# EAGLE design ltc3886circuit_rev1 (EAGLE 9.3.0)
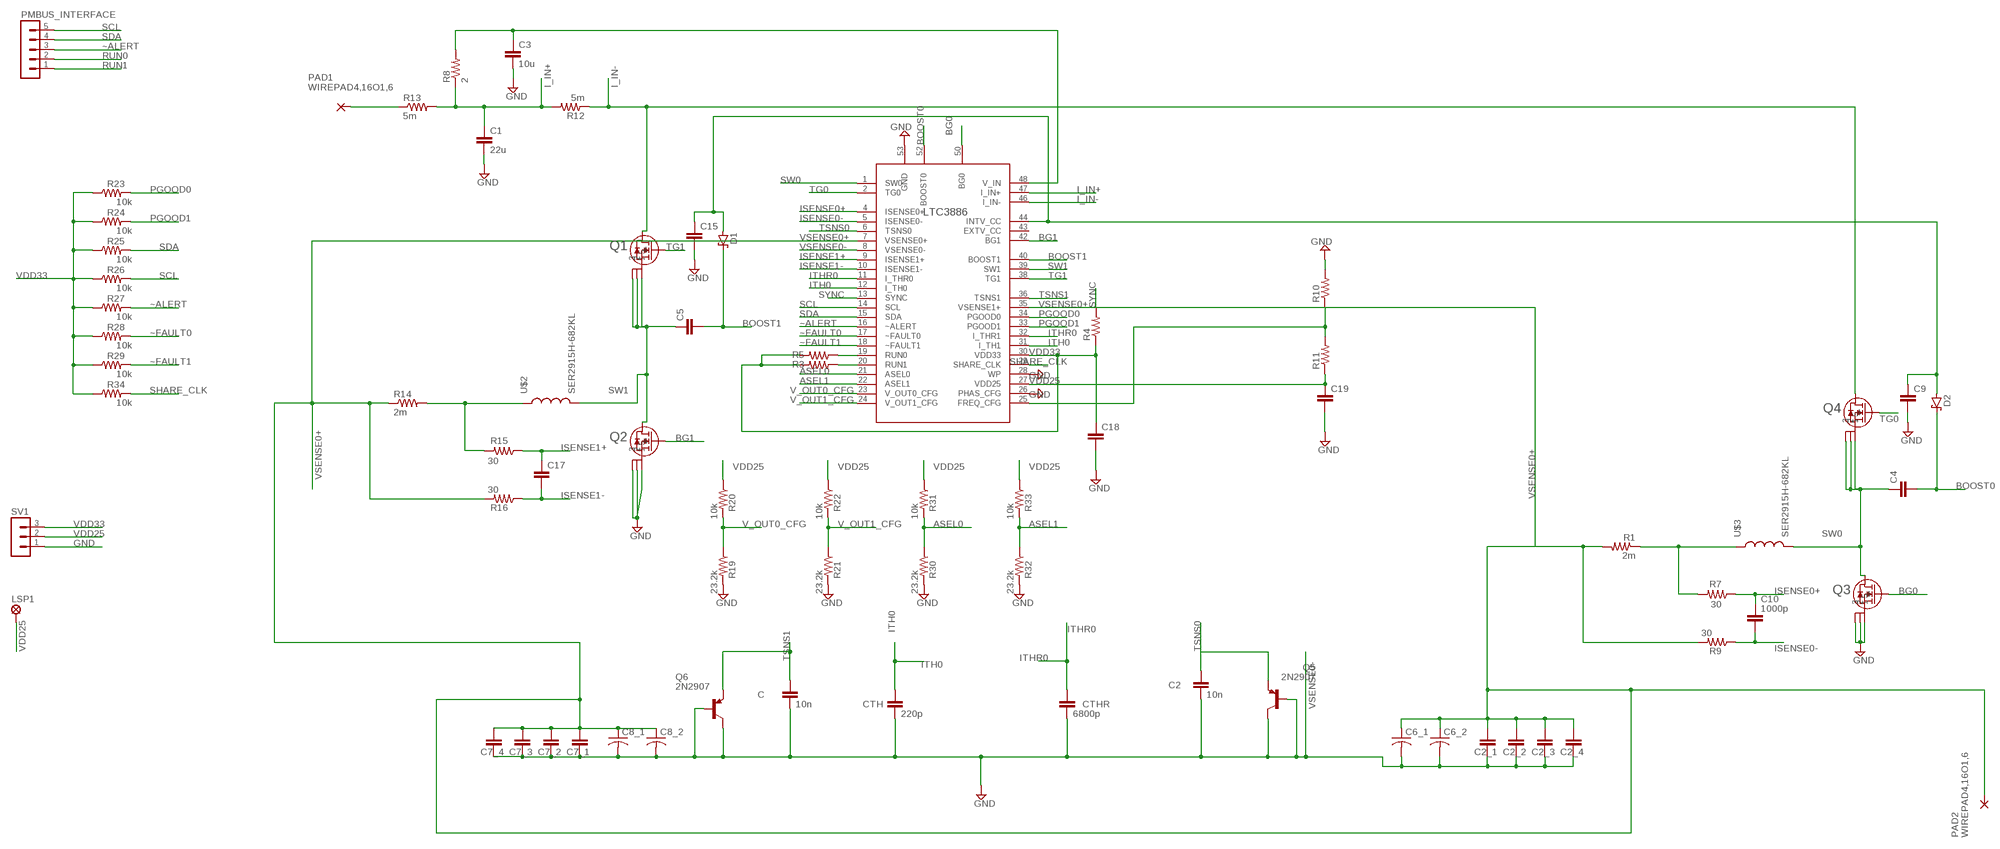
[diagram p0: schematic, sheet 1]

## Parts
C  10n  C-EU075-032X103  [C075-032X103]
C1  22u  C-EU075-032X103  [C075-032X103]
C2  10n  C-EU075-032X103  [C075-032X103]
C2_1  ESK226M100AE3AA(22UF_CAP)  [ESK226M100AE3AA(22UF_CAP)]
C2_2  ESK226M100AE3AA(22UF_CAP)  [ESK226M100AE3AA(22UF_CAP)]
C2_3  ESK226M100AE3AA(22UF_CAP)  [ESK226M100AE3AA(22UF_CAP)]
C2_4  ESK226M100AE3AA(22UF_CAP)  [ESK226M100AE3AA(22UF_CAP)]
C3  10u  C-EU075-032X103  [C075-032X103]
C4  C-EU075-032X103  [C075-032X103]
C5  C-EU075-032X103  [C075-032X103]
C6_1  C-US050-025X075  [C050-025X075]
C6_2  C-US050-025X075  [C050-025X075]
C7_1  ESK226M100AE3AA(22UF_CAP)  [ESK226M100AE3AA(22UF_CAP)]
C7_2  ESK226M100AE3AA(22UF_CAP)  [ESK226M100AE3AA(22UF_CAP)]
C7_3  ESK226M100AE3AA(22UF_CAP)  [ESK226M100AE3AA(22UF_CAP)]
C7_4  ESK226M100AE3AA(22UF_CAP)  [ESK226M100AE3AA(22UF_CAP)]
C8_1  C-US050-025X075  [C050-025X075]
C8_2  C-US050-025X075  [C050-025X075]
C9  C-EU075-032X103  [C075-032X103]
C10  1000p  C-EU075-032X103  [C075-032X103]
C15  C-EU075-032X103  [C075-032X103]
C17  C-EU075-032X103  [C075-032X103]
C18  C-EU075-032X103  [C075-032X103]
C19  C-EU075-032X103  [C075-032X103]
CTH  220p  C-EU075-032X103  [C075-032X103]
CTHR  6800p  C-EU075-032X103  [C075-032X103]
D1  SCHOTTKY-DIODECB417-15  [CB417-15]
D2  SCHOTTKY-DIODECB417-15  [CB417-15]
LSP1  MCS08  [MCS08]
PAD1  WIREPAD4,16O1,6  [4,16O1,6]
PAD2  WIREPAD4,16O1,6  [4,16O1,6]
PMBUS_INTERFACE  MA05-1  [MA05-1]
Q1  RJK0651DPB-00J5  [LFPAK]
Q2  RJK0651DPB-00J5  [LFPAK]
Q3  RJK0651DPB-00J5  [LFPAK]
Q4  RJK0651DPB-00J5  [LFPAK]
Q5  2N2907  [TO18]
Q6  2N2907  [TO18]
R1  2m  CSS2H-2512K-2L00FE  [CSS2H-2512K-2L00FE]
R3  R-US_0207/12  [0207/12]
R4  R-US_0207/12  [0207/12]
R5  R-US_0207/12  [0207/12]
R7  30  R-US_0207/12  [0207/12]
R8  2  ERJ-B1BF2R0U(2-OHM)  [ERJ-B1BF2R0U(2-OHM)]
R9  30  R-US_0207/12  [0207/12]
R10  R-US_0207/12  [0207/12]
R11  R-US_0207/12  [0207/12]
R12  5m  R-US_0204/5  [0204/5]
R13  5m  CSS2H-2512K-2L00FE  [CSS2H-2512K-2L00FE]
R14  2m  CSS2H-2512K-2L00FE  [CSS2H-2512K-2L00FE]
R15  30  R-US_0207/12  [0207/12]
R16  30  R-US_0207/12  [0207/12]
R19  23.2k  R-US_0207/12  [0207/12]
R20  10k  R-US_0207/12  [0207/12]
R21  23.2k  R-US_0207/12  [0207/12]
R22  10k  R-US_0207/12  [0207/12]
R23  10k  R-US_0207/12  [0207/12]
R24  10k  R-US_0207/12  [0207/12]
R25  10k  R-US_0207/12  [0207/12]
R26  10k  R-US_0207/12  [0207/12]
R27  10k  R-US_0207/12  [0207/12]
R28  10k  R-US_0207/12  [0207/12]
R29  10k  R-US_0207/12  [0207/12]
R30  23.2k  R-US_0207/12  [0207/12]
R31  10k  R-US_0207/12  [0207/12]
R32  23.2k  R-US_0207/12  [0207/12]
R33  10k  R-US_0207/12  [0207/12]
R34  10k  R-US_0207/12  [0207/12]
SV1  MA03-1  [MA03-1]
U$1  LTC3886  [QFN-52_UKG_2]
U$2  SER2915H-682KL  [SER2915H-682KL]
U$3  SER2915H-682KL  [SER2915H-682KL]

## Nets
ASEL0: R30.1 R31.2 U$1.21(ASEL0)
ASEL1: R32.1 R33.2 U$1.22(ASEL1)
BG0: Q3.4 U$1.50(BG0)
BG1: Q2.4 U$1.42(BG1)
BOOST0: C4.2 D2.C U$1.52(BOOST0)
BOOST1: C5.2 D1.C U$1.40(BOOST1)
GND: C1.2 C3.2 C9.2 C15.2 C18.2 C19.2 Q2.1 Q2.2 Q2.3 Q3.1 Q3.2 Q3.3 R10.2 R19.2 R21.2 R30.2 R32.2 SV1.1 U$1.26(PHAS_CFG) U$1.28(WP) U$1.53(GND)
I_IN+: C1.1 R8.P$1 R12.2 R13.P$2 U$1.47(I_IN+)
I_IN-: Q1.5 Q4.5 R12.1 U$1.46(I_IN-)
ISENSE0+: C10.1 R7.1 U$1.4(ISENSE0+)
ISENSE0-: C10.2 R9.1 U$1.5(ISENSE0-)
ISENSE1+: C17.1 R15.1 U$1.9(ISENSE1+)
ISENSE1-: C17.2 R16.1 U$1.10(ISENSE1-)
ITH0: CTH.1 U$1.12(I_TH0) U$1.31(I_TH1)
ITHR0: CTHR.1 U$1.11(I_THR0) U$1.32(I_THR1)
N$2: R5.1 U$1.19(RUN0)
N$3: R3.1 U$1.20(RUN1)
N$4: R14.P$2 R15.2 U$2.P$1
N$5: C9.1 C15.1 D1.A D2.A U$1.44(INTV_CC)
N$8: R1.P$1 R7.2 U$3.P$1
N$17: PAD1.1(P) R13.P$1
N$19: C3.1 R8.P$2 U$1.48(V_IN)
N$24: R10.1 R11.2 U$1.25(FREQ_CFG)
PGOOD0: R23.2 U$1.34(PGOOD0)
PGOOD1: R24.2 U$1.33(PGOOD1)
RUN0: PMBUS_INTERFACE.2
RUN1: PMBUS_INTERFACE.1
SCL: PMBUS_INTERFACE.5 R26.2 U$1.14(SCL)
SDA: PMBUS_INTERFACE.4 R25.2 U$1.15(SDA)
SHARE_CLK: R34.2 U$1.29(SHARE_CLK)
SW0: C4.1 Q3.5 Q4.1 Q4.2 Q4.3 U$1.1(SW0) U$3.P$2
SW1: C5.1 Q1.1 Q1.2 Q1.3 Q2.5 U$1.39(SW1) U$2.P$2
SYNC: R4.2 U$1.13(SYNC)
TG0: Q4.4 U$1.2(TG0)
TG1: Q1.4 U$1.38(TG1)
TSNS0: C2.1 Q5.1(E) U$1.6(TSNS0)
TSNS1: C.1 Q6.1(E) U$1.36(TSNS1)
V_OUT0_CFG: R19.1 R20.2 U$1.23(V_OUT0_CFG)
V_OUT1_CFG: R21.1 R22.2 U$1.24(V_OUT1_CFG)
VDD25: C19.1 LSP1.MP R11.1 R20.1 R22.1 R31.1 R33.1 SV1.2 U$1.27(VDD25)
VDD33: C18.1 R3.2 R4.1 R5.2 R23.1 R24.1 R25.1 R26.1 R27.1 R28.1 R29.1 R34.1 SV1.3 U$1.30(VDD33)
VSENSE0+: C2_1.P$1 C2_2.P$1 C2_3.P$1 C2_4.P$1 C6_1.1 C6_2.1 C7_1.P$1 C7_2.P$1 C7_3.P$1 C7_4.P$1 C8_1.1 C8_2.1 PAD2.1(P) R1.P$2 R9.2 R14.P$1 R16.2 U$1.7(VSENSE0+) U$1.35(VSENSE1+)
VSENSE0-: C2.2 C2_1.P$2 C2_2.P$2 C2_3.P$2 C2_4.P$2 C6_1.2 C6_2.2 C7_1.P$2 C7_2.P$2 C7_3.P$2 C7_4.P$2 C8_1.2 C8_2.2 C.2 CTH.2 CTHR.2 Q5.2(B) Q5.3(C) Q6.2(B) Q6.3(C) U$1.8(VSENSE0-) ; supply symbol labelled GND
~ALERT: PMBUS_INTERFACE.3 R27.2 U$1.16(~ALERT)
~FAULT0: R28.2 U$1.17(~FAULT0)
~FAULT1: R29.2 U$1.18(~FAULT1)
Unconnected: U$1.43(EXTV_CC)

## Library data of the parts
C C1-C5 C9 C10 C15 C17-C19 CTH CTHR = rcl:C-EU: CAPACITOR, European symbol; SPICEPREFIX: C
C2_1-C2_4 C7_1-C7_4 = power_subsystem_components:ESK226M100AE3AA(22UF_CAP)
C6_1 C6_2 C8_1 C8_2 = rcl:C-US: CAPACITOR, American symbol; SPICEPREFIX: C
D1 D2 = diode:SCHOTTKY-DIODE: Schottky Diode
LSP1 = solpad:MCS08: SOLDER PAD MC S0,8, drill 1.2 mm, distributor Buerklin, 08F130
PAD1 PAD2 = wirepad:WIREPAD: Wire PAD connect wire on PCB
PMBUS_INTERFACE = con-lstb:MA05-1: PIN HEADER; OC_FARNELL: unknown; OC_NEWARK: unknown
Q1-Q4 = SamacSys_Parts:RJK0651DPB-00J5; MANUFACTURER_PART_NUMBER: RJK0651DPB00#J5; VENDOR: Renesas Electronics
Q5 Q6 = transistor-pnp:2N2907*: PNP Transistor
R1 R13 R14 = power_subsystem_components:CSS2H-2512K-2L00FE
R3-R5 R7 R9-R12 R15 R16 R19-R34 = rcl:R-US_: RESISTOR, American symbol; SPICEPREFIX: R
R8 = power_subsystem_components:ERJ-B1BF2R0U(2-OHM)
SV1 = con-lstb:MA03-1: PIN HEADER; OC_FARNELL: unknown; OC_NEWARK: unknown
U$1 = ltc3886:LTC3886
U$2 U$3 = power_subsystem_components:SER2915H-682KL

## Board
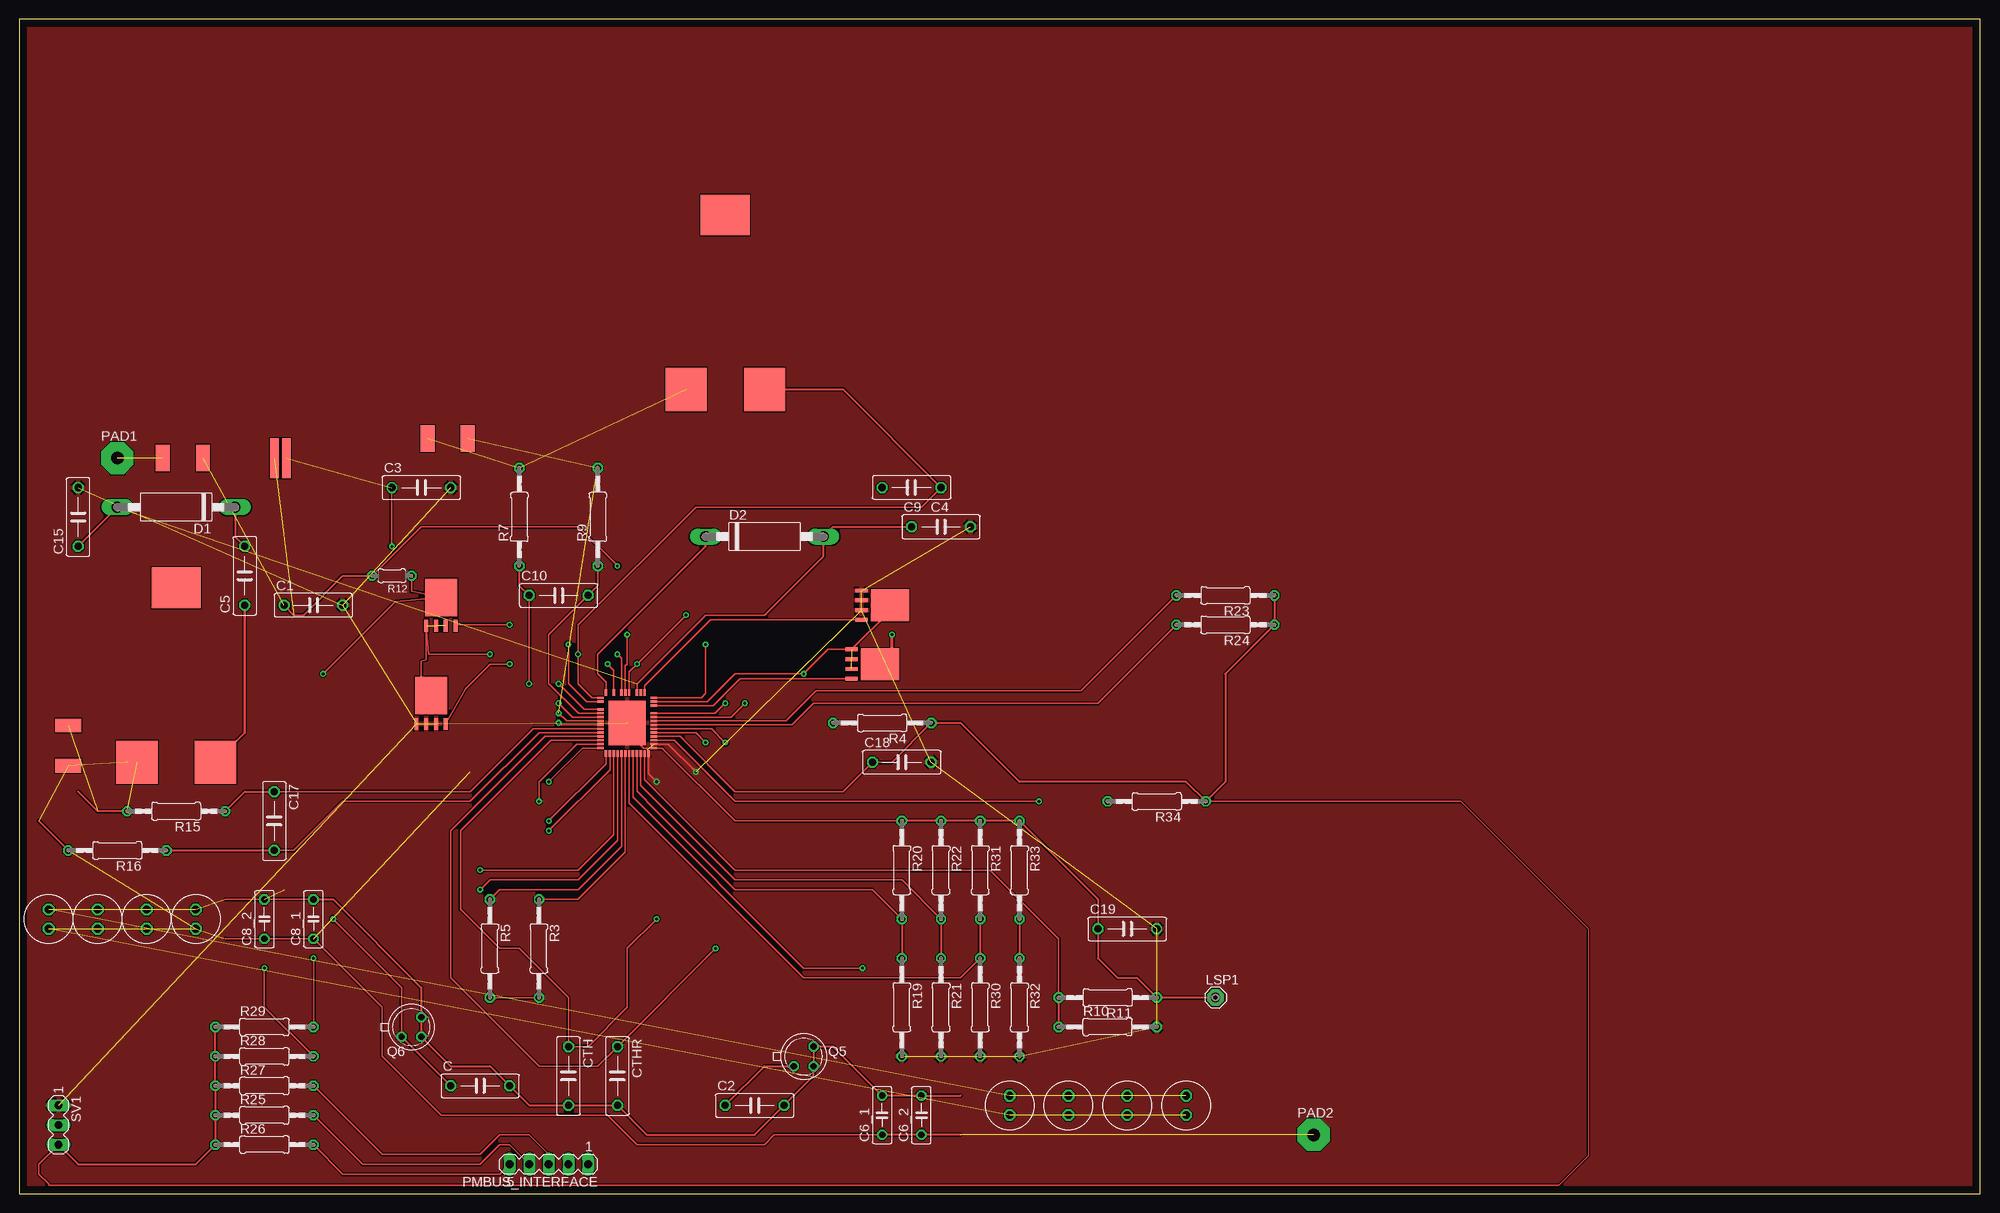
[diagram p1: board, top side]
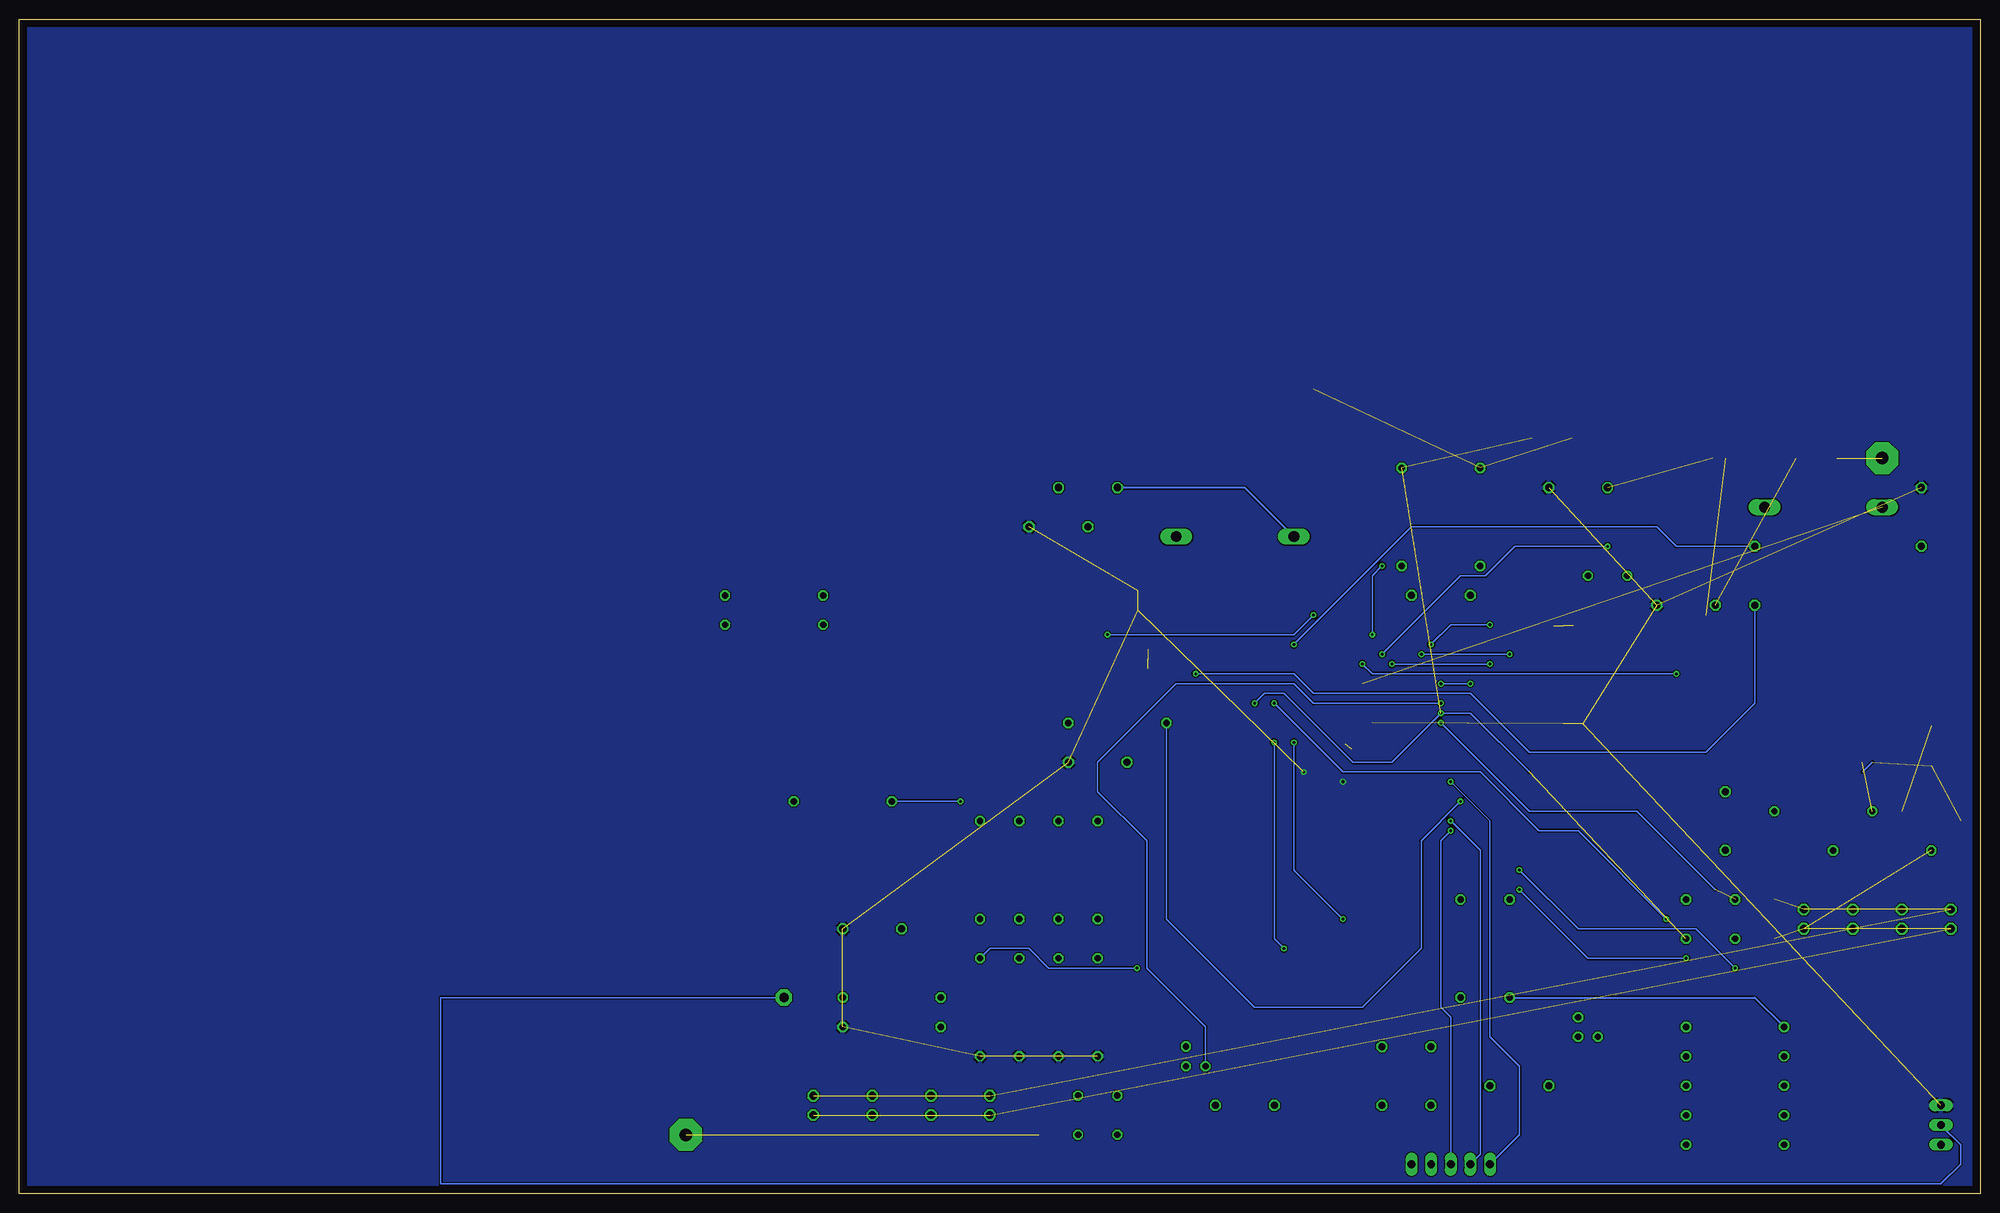
[diagram p2: board, bottom side, seen from below]

Size 253.98 x 152.07 mm. Coordinates in mm from the lower left corner, seen from the top.
Outline: 0,0 253.98,0 253.98,152.07 0,152.07 0,0
Copper layers (1*16): Top 0.035mm / dielectric 1.5mm / Bottom 0.035mm
Design rules "default": minimum track width 6mil, minimum drill 0.35mm, track to track 6mil, track to pad 6mil, pad to pad 6mil, via to via 6mil, smd to smd 6mil, copper to edge 40mil, drill to drill 6mil, minimum pad ring 10mil, minimum via ring 8mil, stop-mask expansion 4mil, vias tented up to drill 0mil, thermal gap 10mil

### Footprints (pad centres in the part's own frame; a part is rotated, then mirrored left to right if it is on the bottom)
C075-032X103 = drill 0.914 octagon: 1 -3.81,0; 2 3.81,0
ESK226M100AE3AA(22UF_CAP) = drill 1 octagon: P$1 -1.25,0; P$2 1.25,0
C050-025X075 = drill 0.813 octagon: 1 -2.54,0; 2 2.54,0
CB417-15 = drill 1.397 long: A 7.62,0; C -7.62,0
MCS08 = drill 1.194 pad 2.159 octagon: MP 0,0
4,16O1,6 = drill 1.6 pad 4.166 octagon: 1 0,0
MA05-1 = drill 1.016 long: 1 -5.08,0; 2 -2.54,0; 3 0,0; 4 2.54,0; 5 5.08,0
LFPAK = smd 1.549 x 0.508: 1 -2.68,1.905; 2 -2.68,0.635; 3 -2.68,-0.635; 4 -2.68,-1.905 | smd 4.902 x 4.14: 5 1.003,0
TO18 = drill 0.813 octagon: 1 -1.27,-1.27; 2 1.27,-1.27; 3 1.27,1.27
CSS2H-2512K-2L00FE = smd 1.8 x 3.4: P$1 -3,0; P$2 2.2,0
0207/12 = drill 0.813 octagon: 1 -6.35,0; 2 6.35,0
ERJ-B1BF2R0U(2-OHM) = smd 1.1 x 5.2: P$1 0,0; P$2 1.6,0
0204/5 = drill 0.813 octagon: 1 -2.54,0; 2 2.54,0
MA03-1 = drill 1.016 long: 1 -2.54,0; 2 0,0; 3 2.54,0
QFN-52_UKG_2 = smd 0.813 x 0.305: 1 -3.454,3.25; 2 -3.454,2.75; 4 -3.454,1.75; 5 -3.454,1.25; 6 -3.454,0.75; 7 -3.454,0.25; 8 -3.454,-0.25; 9 -3.454,-0.75; 10 -3.454,-1.25; 11 -3.454,-1.75; 12 -3.454,-2.25; 13 -3.454,-2.75; 14 -3.454,-3.25; 27 3.454,-3.25; 28 3.454,-2.75; 29 3.454,-2.25; 30 3.454,-1.75; 31 3.454,-1.25; 32 3.454,-0.75; 33 3.454,-0.25; 34 3.454,0.25; 35 3.454,0.75; 36 3.454,1.25; 38 3.454,2.25; 39 3.454,2.75; 40 3.454,3.25 | smd 0.305 x 0.813: 15 -2.75,-3.95; 16 -2.25,-3.95; 17 -1.75,-3.95; 18 -1.25,-3.95; 19 -0.75,-3.95; 20 -0.25,-3.95; 21 0.25,-3.95; 22 0.75,-3.95; 23 1.25,-3.95; 24 1.75,-3.95; 25 2.25,-3.95; 26 2.75,-3.95; 42 2.25,3.95; 43 1.75,3.95; 44 1.25,3.95; 46 0.25,3.95; 47 -0.25,3.95; 48 -0.75,3.95; 50 -1.75,3.95; 52 -2.75,3.95 | smd 4.801 x 5.791: 53 0,0
SER2915H-682KL = smd 5.33 x 5.59: P$1 -5.075,0; P$2 5.075,0 | smd 6.35 x 5.28: P$3 0,22.6

### Placement (x,y rotation side)
C  59.69,13.97 0 top
C1  38.1,76.2 0 top
C2  95.25,11.43 0 top
C2_1  151.13,11.43 90 top
C2_2  143.51,11.43 90 top
C2_3  135.89,11.43 90 top
C2_4  128.27,11.43 90 top
C3  52.07,91.44 0 top
C4  115.57,91.44 180 top
C5  29.21,80.01 90 top
C6_1  111.76,10.16 90 top
C6_2  116.84,10.16 90 top
C7_1  3.81,35.56 90 top
C7_2  10.16,35.56 90 top
C7_3  16.51,35.56 90 top
C7_4  22.86,35.56 90 top
C8_1  38.1,35.56 90 top
C8_2  31.75,35.56 90 top
C9  119.38,86.36 0 top
C10  69.85,77.47 0 top
C15  7.62,87.63 90 top
C17  33.02,48.26 270 top
C18  114.3,55.88 0 top
C19  143.51,34.29 0 top
CTH  71.12,15.24 270 top
CTHR  77.47,15.24 270 top
D1  20.32,88.9 180 top
D2  96.52,85.09 0 top
LSP1  154.94,25.4 0 top
PAD1  12.7,95.25 0 top
PAD2  167.64,7.62 0 top
PMBUS_INTERFACE  68.58,3.81 180 top
Q1  110.49,68.58 0 top
Q2  111.76,76.2 0 top
Q3  53.34,63.5 90 top
Q4  54.61,76.2 90 top
Q5  101.6,17.78 0 top
Q6  50.8,21.59 0 top
R1  55.88,97.79 0 top
R3  67.31,31.75 270 top
R4  111.76,60.96 180 top
R5  60.96,31.75 270 top
R7  64.77,87.63 90 top
R8  33.02,95.25 0 top
R9  74.93,87.63 90 top
R10  140.97,21.59 0 top
R11  140.97,25.4 180 top
R12  48.26,80.01 180 top
R13  21.59,95.25 0 top
R14  6.35,58.42 90 top
R15  20.32,49.53 180 top
R16  12.7,44.45 180 top
R19  114.3,24.13 270 top
R20  114.3,41.91 270 top
R21  119.38,24.13 270 top
R22  119.38,41.91 270 top
R23  156.21,77.47 180 top
R24  156.21,73.66 180 top
R25  31.75,10.16 0 top
R26  31.75,6.35 0 top
R27  31.75,13.97 0 top
R28  31.75,17.78 0 top
R29  31.75,21.59 0 top
R30  124.46,24.13 270 top
R31  124.46,41.91 270 top
R32  129.54,24.13 270 top
R33  129.54,41.91 270 top
R34  147.32,50.8 180 top
SV1  5.08,8.89 270 top
U$1  78.74,60.96 0 top
U$2  20.32,55.88 0 top
U$3  91.44,104.14 0 top

### Tracks (layer width: path | path; a pad name or v marks a point on that pad's centre or on a via)
ASEL0
  Top 0.203: U$1.21 78.99,50.55 101.6,27.94 121.92,27.94 R30.1
  Top 0.254: R31.2 R30.1
ASEL1  (via drill 0.35)
  Top 0.203: U$1.22 79.49,51.32 101.6,29.21 v109.22,29.21
  Top 0.254: R33.2 R32.1
  Bottom 0.203: R32.1 128.27,31.75 123.19,31.75 120.65,29.21 v109.22,29.21
BG0  (via drill 0.35)
  Top 0.203: Q3.4 57.78,65.41 60.96,68.58 v63.5,68.58 | U$1.50 76.99,67.79 v76.2,68.58
  Bottom 0.203: v76.2,68.58 v63.5,68.58
BG1
  Top 0.203: U$1.42 80.99,65.75 89.53,74.3 Q2.4
BOOST0
  Top 0.203: 74.93,69.85 74.93,67.31 75.99,66.25 U$1.52
  Top 0.254: 74.93,69.85 88.9,83.82 D2.C
  Bottom 0.254: D2.C 95.25,91.44 C4.2
BOOST1  (via drill 0.35)
  Top 0.203: U$1.40 88.34,64.21 88.9,64.77 v88.9,71.12
  Top 0.254: D1.C 27.94,85.09 C5.2
  Bottom 0.203: C5.2 39.37,83.82 41.91,86.36 73.66,86.36 v88.9,71.12
GND  (via drill 0.35)  (19 unrouted)
  Top 0.203: U$1.28 84.03,58.21 v87.63,54.61 | v82.55,53.34 81.49,54.4 U$1.26 81.4,57.1 81.4,57.52 81.25,57.67 80.83,57.67 78.74,59.76 U$1.53
  pour Top: -5.08,-3.81 -5.08,163.83 300.99,163.83 300.99,-7.62 -1.27,-7.62
  pour Bottom: -6.35,-8.89 -6.35,167.64 307.34,160.28 307.34,-8.89
  pour Bottom: -15.24,-8.89 -15.24,170.18 -10.16,175.26 325.12,175.26 334.01,166.37 334.01,-35.56 10.16,-35.56 -15.24,-10.16 -13.97,-8.89
I_IN+  (via drill 0.35)  (2 unrouted)
  Top 0.203: R12.2 52.07,86.36 72.39,86.36 v77.47,81.28 | U$1.47 78.49,68.33 78.74,68.58 v78.74,72.39
  Top 0.254: C1.1 35.56,74.93 36.83,74.93 41.91,80.01 R12.2
  Bottom 0.203: v77.47,81.28 78.74,80.01 v78.74,72.39
I_IN-  (via drill 0.35)
  Top 0.203: R12.1 50.8,78 Q4.5 48.68,76.62 v39.37,67.31 | U$1.46 78.99,67.56 v80.01,68.58 v86.36,74.93
  Top 0.406: Q1.5 113.03,70.12 v113.03,72.39
  Bottom 0.203: v113.03,72.39 88.9,72.39 v86.36,74.93 | v39.37,67.31 78.74,67.31 v80.01,68.58
ISENSE0+  (via drill 0.35)
  Top 0.203: C10.1 v66.04,66.04 | U$1.4 73.18,62.71 v69.85,66.04
  Top 0.254: R7.1 64.77,78.74 C10.1
  Bottom 0.203: v69.85,66.04 v66.04,66.04
ISENSE0-
  Top 0.203: C10.2 68.58,72.39 68.58,66.04 72.41,62.21 U$1.5
  Top 0.254: R9.1 74.93,78.74 C10.2
ISENSE1+
  Top 0.203: U$1.9 66.56,60.21 58.42,52.07 C17.1
  Top 0.254: R15.1 29.21,52.07 C17.1
ISENSE1-
  Top 0.203: U$1.10 75.27,59.69 67.31,59.69 58.42,50.8 41.91,50.8 35.56,44.45 C17.2
  Top 0.254: R16.1 C17.2
ITH0  (via drill 0.35)
  Top 0.203: U$1.12 68.87,58.71 57.15,46.99 57.15,36.83 62.23,31.75 64.77,31.75 71.12,25.4 CTH.1 73.66,19.05 78.74,24.13 78.74,31.75 v82.55,35.56 | U$1.31 82.21,59.69 87.63,59.69 v88.9,58.42
  Bottom 0.203: v88.9,58.42 88.9,41.91 v82.55,35.56
ITHR0  (via drill 0.35)
  Top 0.203: U$1.11 68.1,59.21 55.88,46.99 55.88,27.94 67.31,16.51 74.93,16.51 CTHR.1 v90.17,31.75 | U$1.32 89.65,60.21 v91.44,58.42
  Bottom 0.203: v91.44,58.42 91.44,33.02 v90.17,31.75
N$2
  Top 0.203: R5.1 62.23,39.37 72.39,39.37 77.99,44.97 U$1.19
N$3
  Top 0.203: R3.1 72.39,38.1 78.49,44.2 U$1.20
N$4  (2 unrouted)
  Top 0.254: R15.2 10.16,49.53 7.62,52.07
N$5  (1 unrouted)
  Top 0.203: 96.52,74.93 88.9,74.93 79.99,66.02 U$1.44
  Top 0.254: D1.A C15.1 | 96.52,74.93 104.14,82.55 D2.A 105.41,86.36 C9.1
N$8  (2 unrouted)
N$17  (1 unrouted)
N$19  (via drill 0.35)  (1 unrouted)
  Top 0.203: U$1.48 77.99,69.33 v77.47,69.85 | v48.26,83.82 C3.1
  Bottom 0.203: v77.47,69.85 67.31,80.01 64.06,80.01 60.25,83.82 v48.26,83.82
N$24
  Top 0.203: R11.2 134.62,33.02 125.73,41.91 92.71,41.91 80.99,53.63 U$1.25
  Top 0.254: R11.2 R10.1
PGOOD0
  Top 0.203: R23.2 137.52,65.13 103.23,65.13 99.31,61.21 U$1.34
PGOOD1
  Top 0.203: U$1.33 100.08,60.71 102.87,63.5 139.7,63.5 R24.2
SCL  (via drill 0.35)
  Top 0.152: 72.95,57.71 v68.58,53.34
  Top 0.203: U$1.14 72.95,57.71 | PMBUS_INTERFACE.5 62.23,2.54 41.91,2.54 R26.2
  Bottom 0.152: v68.58,53.34 63.5,48.26
  Bottom 0.203: 63.5,48.26 63.5,20.32 59.69,16.51 59.69,7.62 PMBUS_INTERFACE.5
SDA  (via drill 0.35)
  Top 0.152: 63.5,6.35 PMBUS_INTERFACE.4
  Top 0.203: U$1.15 75.99,55.67 v68.58,48.26 | 63.5,6.35 62.23,6.35 59.69,3.81 44.45,3.81 R25.2
  Bottom 0.203: v68.58,48.26 64.77,44.45 64.77,5.08 PMBUS_INTERFACE.4
SHARE_CLK  (via drill 0.35)
  Top 0.203: U$1.29 84.8,58.71 92.71,50.8 v132.08,50.8
  Bottom 0.203: v132.08,50.8 R34.2
SW0  (via drill 0.35)  (2 unrouted)
  Top 0.2: 87.63,88.9 116.84,88.9 C4.1
  Top 0.203: Q3.5 52.07,65.77 52.07,68.93 52.7,69.13 Q4.1 53.02,69.85 v60.96,69.85 | 87.63,88.9 72.39,73.66 v72.39,69.85 72.39,66.04 74.22,64.21 U$1.1
  Top 0.254: U$3.P$2 106.68,104.14 C4.1
  Bottom 0.203: v60.96,69.85 v72.39,69.85
SW1  (via drill 0.35)  (2 unrouted)
  Top 0.203: Q2.5 112.76,75.44 Q1.1 104.78,70.48 v101.6,67.31 92.71,67.31 89.11,63.71 U$1.39
  Top 0.305: C5.1 29.21,59.7 U$2.P$2
  Bottom 0.203: v101.6,67.31 88.9,67.31 86.36,64.77 66.04,64.77 58.42,57.15 35.56,57.15 29.21,63.5 C5.1
SYNC  (via drill 0.35)
  Top 0.203: U$1.13 72.18,58.21 67.31,53.34 v67.31,50.8
  Bottom 0.203: v67.31,50.8 72.39,45.72 72.39,31.75 80.01,24.13 93.98,24.13 105.41,35.56 R4.2
TG0  (via drill 0.35)
  Top 0.203: U$1.2 73.45,63.71 71.12,66.04 v71.12,71.12 | v63.5,73.66 56.67,73.66 Q4.4
  Bottom 0.203: v71.12,71.12 68.58,73.66 v63.5,73.66
TG1
  Top 0.203: U$1.38 89.88,63.21 93.34,66.67 Q1.4
TSNS0  (via drill 0.35)
  Top 0.203: U$1.6 71.64,61.71 v69.85,63.5
  Top 0.254: C2.1 96.52,16.51 Q5.1
  Bottom 0.203: Q5.1 100.33,21.59 107.95,29.21 107.95,45.72 114.3,52.07 114.3,55.88 104.14,66.04 88.9,66.04 86.36,63.5 v69.85,63.5
TSNS1  (via drill 0.35)
  Top 0.203: Q6.1 49.53,26.67 v40.64,35.56 | v91.44,63.5 90.15,62.21 U$1.36
  Top 0.254: Q6.1 C.1
  Bottom 0.203: v40.64,35.56 52.07,46.99 57.15,46.99 64.77,54.61 82.55,54.61 v91.44,63.5
V_OUT0_CFG
  Top 0.203: U$1.23 79.99,52.09 82.55,49.53 92.71,39.37 110.49,39.37 R20.2
  Top 0.254: R20.2 R19.1
V_OUT1_CFG
  Top 0.203: U$1.24 80.49,52.86 92.71,40.64 114.3,40.64 R22.2
  Top 0.254: R22.2 R21.1
VDD25
  Top 0.203: U$1.27 83.26,57.71 92.71,48.26 R20.1
  Top 0.254: R20.1 R22.1 R31.1 R33.1 139.7,38.1 C19.1 139.7,30.48 142.24,27.94 144.78,27.94 R11.1 LSP1.MP
  Bottom 0.203: LSP1.MP 199.39,25.4 199.39,1.27 5.08,1.27 2.54,3.81 2.54,6.35 SV1.2
VDD33
  Top 0.152: 186.69,50.8 203.2,34.29 203.2,4.93 199.39,1.12
  Top 0.203: R5.2 R3.2 | U$1.30 85.57,59.21 92.71,52.07 106.68,52.07 C18.1 113.03,55.88 R4.1 | SV1.3 2.54,3.81 2.54,2.54 3.81,1.27 3.81,1.12 199.39,1.12 | R34.1 186.69,50.8
  Top 0.254: R29.1 R28.1 R27.1 R25.1 R26.1 22.86,3.81 7.62,3.81 SV1.3 | R23.1 R24.1 156.21,67.31 156.21,53.34 R34.1 151.13,53.34 129.54,53.34 121.92,60.96 R4.1
  Bottom 0.254: R5.2 29.21,25.4 R29.1
VSENSE0+  (via drill 0.35)  (15 unrouted)
  Top 0.203: 26.67,33.02 C8_2.1 C8_1.1 46.99,24.13 46.99,17.78 54.61,10.16 76.2,10.16 80.01,6.35 96.52,6.35 97.79,7.62 C6_1.1 | U$1.7 70.87,61.21 v69.85,62.23 | U$1.35 92.19,61.71 v93.98,63.5
  Top 0.254: C6_1.1 C6_2.1 121.92,7.62 | 2.54,48.26 R16.2
  Bottom 0.203: 58.42,54.61 66.04,62.23 v69.85,62.23 76.2,55.88 81.28,55.88 90.17,64.77 92.71,64.77 v93.98,63.5 | 15.24,54.61 13.97,55.88
VSENSE0-  (via drill 0.35)  (9 unrouted)
  Top 0.203: C8_1.2 C8_2.2 26.67,38.1 | U$1.8 70.1,60.71 v69.85,60.96
  Top 0.254: 121.92,12.7 C6_2.2 C6_1.2 105.41,19.05 Q5.3 Q5.2 102.87,15.24 C2.2 95.25,7.62 81.28,7.62 CTHR.2 CTH.2 66.04,11.43 C.2 60.96,16.51 55.88,16.51 Q6.2 Q6.3 52.07,26.67 40.64,38.1 C8_1.2
  Bottom 0.203: v69.85,60.96 58.42,49.53 44.45,49.53 34.29,39.37
~ALERT  (via drill 0.35)
  Top 0.152: 66.04,7.62 68.58,5.08 PMBUS_INTERFACE.3
  Top 0.203: U$1.16 76.49,54.9 v68.58,46.99 | 66.04,7.62 62.23,7.62 59.69,5.08 46.99,5.08 R27.2
  Bottom 0.203: v68.58,46.99 69.85,45.72 69.85,24.13 68.58,22.86 PMBUS_INTERFACE.3
~FAULT0  (via drill 0.35)
  Top 0.203: U$1.17 76.99,46.51 72.39,41.91 v59.69,41.91 | v31.75,29.21 31.75,24.13 R28.2
  Bottom 0.203: v59.69,41.91 52.07,34.29 36.81,34.29 35.92,33.4 35.92,33.38 v31.75,29.21
~FAULT1  (via drill 0.35)
  Top 0.203: U$1.18 77.49,45.74 72.39,40.64 60.96,40.64 v59.69,39.37 | v38.1,30.48 R29.2
  Bottom 0.203: v59.69,39.37 50.8,30.48 v38.1,30.48